# EAGLE design SMT Nixie Board (HV5623) (EAGLE 9.6.2)
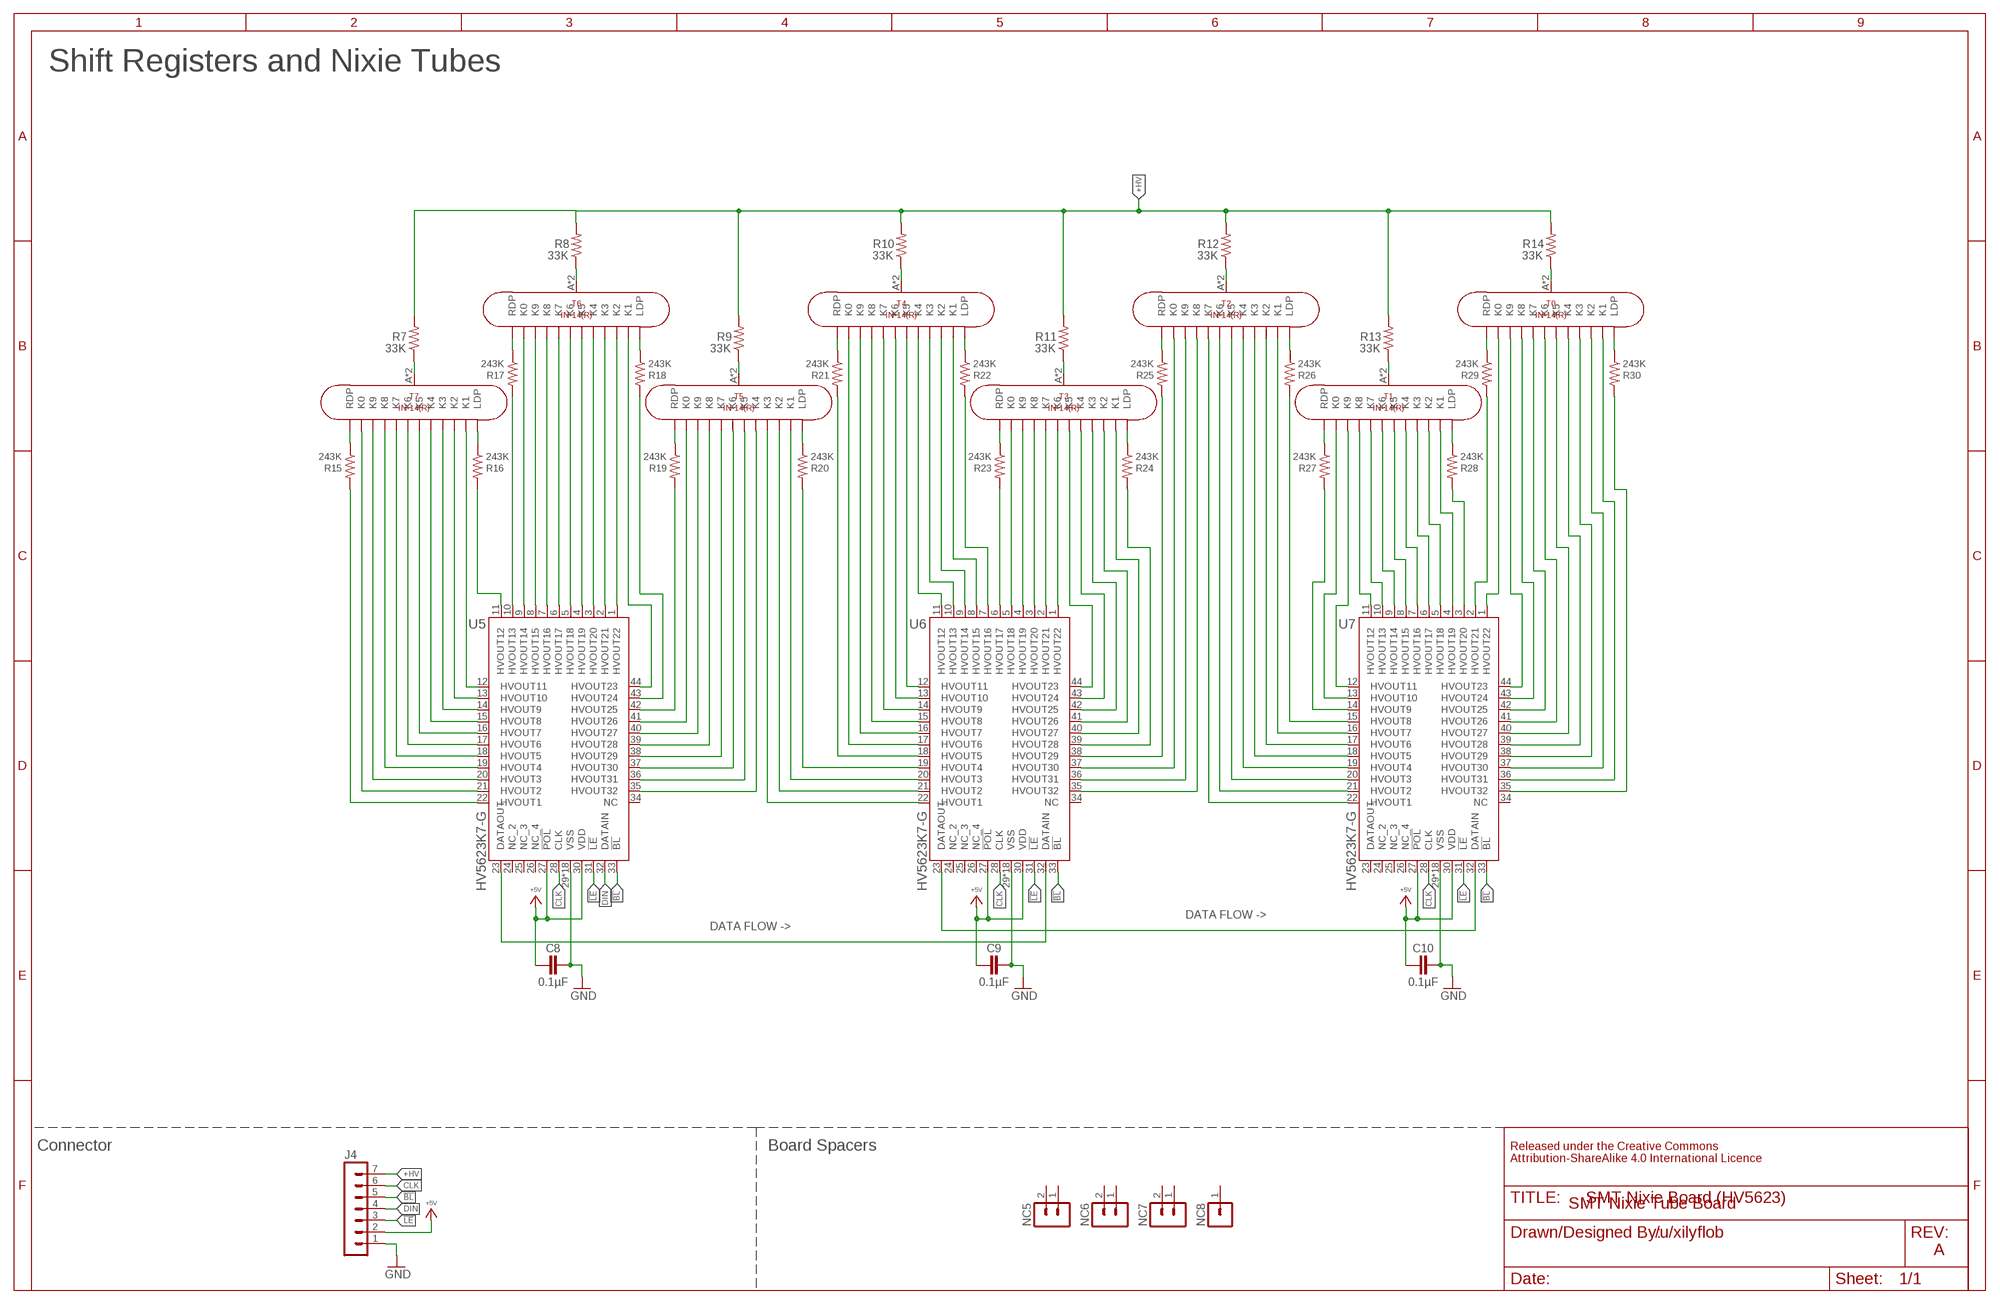
[diagram p0: schematic, sheet 1]

## Parts
C8  0.1µF  C-EU  [C0805]
C9  0.1µF  C-EU  [C0805]
C10  0.1µF  C-EU  [C0805]
J4  1  MA07  [MA07]
NC5  MA02  [MA02]
NC6  MA02  [MA02]
NC7  MA02  [MA02]
NC8  MA01  [MA01]
R7  33K  R-US_R2512  [R2512]
R8  33K  R-US_R2512  [R2512]
R9  33K  R-US_R2512  [R2512]
R10  33K  R-US_R2512  [R2512]
R11  33K  R-US_R2512  [R2512]
R12  33K  R-US_R2512  [R2512]
R13  33K  R-US_R2512  [R2512]
R14  33K  R-US_R2512  [R2512]
R15  243K  R-US_R2010  [R2010]
R16  243K  R-US_R2010  [R2010]
R17  243K  R-US_R2010  [R2010]
R18  243K  R-US_R2010  [R2010]
R19  243K  R-US_R2010  [R2010]
R20  243K  R-US_R2010  [R2010]
R21  243K  R-US_R2010  [R2010]
R22  243K  R-US_R2010  [R2010]
R23  243K  R-US_R2010  [R2010]
R24  243K  R-US_R2010  [R2010]
R25  243K  R-US_R2010  [R2010]
R26  243K  R-US_R2010  [R2010]
R27  243K  R-US_R2010  [R2010]
R28  243K  R-US_R2010  [R2010]
R29  243K  R-US_R2010  [R2010]
R30  243K  R-US_R2010  [R2010]
T0  IN-14(R)  [IN-14_REVERSE]
T1  IN-14(R)  [IN-14_REVERSE]
T2  IN-14(R)  [IN-14_REVERSE]
T3  IN-14(R)  [IN-14_REVERSE]
T4  IN-14(R)  [IN-14_REVERSE]
T5  IN-14(R)  [IN-14_REVERSE]
T6  IN-14(R)  [IN-14_REVERSE]
T7  IN-14(R)  [IN-14_REVERSE]
U5  HV5623K7-G  [WQFN-44]
U6  HV5623K7-G  [WQFN-44]
U7  HV5623K7-G  [WQFN-44]

## Nets
!BL!: J4.5 U5.33(!BL) U6.33(!BL) U7.33(!BL)
!LE!: J4.3 U5.31(!LE) U6.31(!LE) U7.31(!LE)
+5V: C8.1 C9.1 C10.1 J4.2 U5.27(!POL) U5.30(VDD) U6.27(!POL) U6.30(VDD) U7.27(!POL) U7.30(VDD)
+HV: J4.7 R7.2 R8.2 R9.2 R10.2 R11.2 R12.2 R13.2 R14.2
CLK: J4.6 U5.28(CLK) U6.28(CLK) U7.28(CLK)
DIN: J4.4 U5.32(DATAIN)
GND: C8.2 C9.2 C10.2 J4.1 U5.29(VSS) U5.P$1(VSS) U5.P$2(VSS) U5.P$3(VSS) U5.P$4(VSS) U5.P$5(VSS) U5.P$6(VSS) U5.P$7(VSS) U5.P$8(VSS) U5.P$9(VSS) U5.P$10(VSS) U5.P$11(VSS) U5.P$12(VSS) U5.P$13(VSS) U5.P$14(VSS) U5.P$15(VSS) U5.P$16(VSS) U5.TP(VSS) U6.29(VSS) U6.P$1(VSS) U6.P$2(VSS) U6.P$3(VSS) U6.P$4(VSS) U6.P$5(VSS) U6.P$6(VSS) U6.P$7(VSS) U6.P$8(VSS) U6.P$9(VSS) U6.P$10(VSS) U6.P$11(VSS) U6.P$12(VSS) U6.P$13(VSS) U6.P$14(VSS) U6.P$15(VSS) U6.P$16(VSS) U6.TP(VSS) U7.29(VSS) U7.P$1(VSS) U7.P$2(VSS) U7.P$3(VSS) U7.P$4(VSS) U7.P$5(VSS) U7.P$6(VSS) U7.P$7(VSS) U7.P$8(VSS) U7.P$9(VSS) U7.P$10(VSS) U7.P$11(VSS) U7.P$12(VSS) U7.P$13(VSS) U7.P$14(VSS) U7.P$15(VSS) U7.P$16(VSS) U7.TP(VSS)
T0A: R7.1 T7.A T7.A_1(A)
T1A: R8.1 T6.A T6.A_1(A)
T2A: R9.1 T5.A T5.A_1(A)
T3A: R10.1 T4.A T4.A_1(A)
T4A: R11.1 T3.A T3.A_1(A)
T5A: R12.1 T2.A T2.A_1(A)
T6A: R13.1 T1.A T1.A_1(A)
T7A: R14.1 T0.A T0.A_1(A)
U5-T0K0: T7.K0 T7.K0_1(K0) U5.21(HVOUT2)
U5-T0K1: T7.K1 T7.K1_1(K1) U5.12(HVOUT11)
U5-T0K2: T7.K2 T7.K2_1(K2) U5.13(HVOUT10)
U5-T0K3: T7.K3 T7.K3_1(K3) U5.14(HVOUT9)
U5-T0K4: T7.K4 T7.K4_1(K4) U5.15(HVOUT8)
U5-T0K5: T7.K5 T7.K5_1(K5) U5.16(HVOUT7)
U5-T0K6: T7.K6 T7.K6_1(K6) U5.17(HVOUT6)
U5-T0K7: T7.K7 T7.K7_1(K7) U5.18(HVOUT5)
U5-T0K8: T7.K8 T7.K8_1(K8) U5.19(HVOUT4)
U5-T0K9: T7.K9 T7.K9_1(K9) U5.20(HVOUT3)
U5-T0LDP: R16.2 U5.11(HVOUT12)
U5-T0LDP1: R16.1 T7.LDP T7.LDP_1(LDP)
U5-T0RDP: R15.2 U5.22(HVOUT1)
U5-T0RDP1: R15.1 T7.RDP T7.RDP_1(RDP)
U5-T1K0: T6.K0 T6.K0_1(K0) U5.9(HVOUT14)
U5-T1K1: T6.K1 T6.K1_1(K1) U5.44(HVOUT23)
U5-T1K2: T6.K2 T6.K2_1(K2) U5.1(HVOUT22)
U5-T1K3: T6.K3 T6.K3_1(K3) U5.2(HVOUT21)
U5-T1K4: T6.K4 T6.K4_1(K4) U5.3(HVOUT20)
U5-T1K5: T6.K5 T6.K5_1(K5) U5.4(HVOUT19)
U5-T1K6: T6.K6 T6.K6_1(K6) U5.5(HVOUT18)
U5-T1K7: T6.K7 T6.K7_1(K7) U5.6(HVOUT17)
U5-T1K8: T6.K8 T6.K8_1(K8) U5.7(HVOUT16)
U5-T1K9: T6.K9 T6.K9_1(K9) U5.8(HVOUT15)
U5-T1LDP: R18.2 U5.43(HVOUT24)
U5-T1LDP1: R18.1 T6.LDP T6.LDP_1(LDP)
U5-T1RDP: R17.2 U5.10(HVOUT13)
U5-T1RDP1: R17.1 T6.RDP T6.RDP_1(RDP)
U5-T2K0: T5.K0 T5.K0_1(K0) U5.41(HVOUT26)
U5-T2K4: T5.K4 T5.K4_1(K4) U5.35(HVOUT32)
U5-T2K5: T5.K5 T5.K5_1(K5) U5.36(HVOUT31)
U5-T2K6: T5.K6 T5.K6_1(K6) U5.37(HVOUT30)
U5-T2K7: T5.K7 T5.K7_1(K7) U5.38(HVOUT29)
U5-T2K8: T5.K8 T5.K8_1(K8) U5.39(HVOUT28)
U5-T2K9: T5.K9 T5.K9_1(K9) U5.40(HVOUT27)
U5-T2RDP: R19.2 U5.42(HVOUT25)
U5-T2RDP1: R19.1 T5.RDP T5.RDP_1(RDP)
U5-U6: U5.23(DATAOUT) U6.32(DATAIN)
U6-T2K1: T5.K1 T5.K1_1(K1) U6.20(HVOUT3)
U6-T2K2: T5.K2 T5.K2_1(K2) U6.21(HVOUT2)
U6-T2K3: T5.K3 T5.K3_1(K3) U6.22(HVOUT1)
U6-T2LDP: R20.2 U6.19(HVOUT4)
U6-T2LDP1: R20.1 T5.LDP T5.LDP_1(LDP)
U6-T3K0: T4.K0 T4.K0_1(K0) U6.17(HVOUT6)
U6-T3K1: T4.K1 T4.K1_1(K1) U6.8(HVOUT15)
U6-T3K2: T4.K2 T4.K2_1(K2) U6.9(HVOUT14)
U6-T3K3: T4.K3 T4.K3_1(K3) U6.10(HVOUT13)
U6-T3K4: T4.K4 T4.K4_1(K4) U6.11(HVOUT12)
U6-T3K5: T4.K5 T4.K5_1(K5) U6.12(HVOUT11)
U6-T3K6: T4.K6 T4.K6_1(K6) U6.13(HVOUT10)
U6-T3K7: T4.K7 T4.K7_1(K7) U6.14(HVOUT9)
U6-T3K8: T4.K8 T4.K8_1(K8) U6.15(HVOUT8)
U6-T3K9: T4.K9 T4.K9_1(K9) U6.16(HVOUT7)
U6-T3LDP: R22.2 U6.7(HVOUT16)
U6-T3LDP1: R22.1 T4.LDP T4.LDP_1(LDP)
U6-T3RDP: R21.2 U6.18(HVOUT5)
U6-T3RDP1: R21.1 T4.RDP T4.RDP_1(RDP)
U6-T4K0: T3.K0 T3.K0_1(K0) U6.5(HVOUT18)
U6-T4K1: T3.K1 T3.K1_1(K1) U6.40(HVOUT27)
U6-T4K2: T3.K2 T3.K2_1(K2) U6.41(HVOUT26)
U6-T4K3: T3.K3 T3.K3_1(K3) U6.42(HVOUT25)
U6-T4K4: T3.K4 T3.K4_1(K4) U6.43(HVOUT24)
U6-T4K5: T3.K5 T3.K5_1(K5) U6.44(HVOUT23)
U6-T4K6: T3.K6 T3.K6_1(K6) U6.1(HVOUT22)
U6-T4K7: T3.K7 T3.K7_1(K7) U6.2(HVOUT21)
U6-T4K8: T3.K8 T3.K8_1(K8) U6.3(HVOUT20)
U6-T4K9: T3.K9 T3.K9_1(K9) U6.4(HVOUT19)
U6-T4LDP: R24.2 U6.39(HVOUT28)
U6-T4LDP1: R24.1 T3.LDP T3.LDP_1(LDP)
U6-T4RDP: R23.2 U6.6(HVOUT17)
U6-T4RDP1: R23.1 T3.RDP T3.RDP_1(RDP)
U6-T5K0: T2.K0 T2.K0_1(K0) U6.37(HVOUT30)
U6-T5K8: T2.K8 T2.K8_1(K8) U6.35(HVOUT32)
U6-T5K9: T2.K9 T2.K9_1(K9) U6.36(HVOUT31)
U6-T5RDP: R25.2 U6.38(HVOUT29)
U6-T5RDP1: R25.1 T2.RDP T2.RDP_1(RDP)
U6-U7: U6.23(DATAOUT) U7.32(DATAIN)
U7-T5K1: T2.K1 T2.K1_1(K1) U7.16(HVOUT7)
U7-T5K2: T2.K2 T2.K2_1(K2) U7.17(HVOUT6)
U7-T5K3: T2.K3 T2.K3_1(K3) U7.18(HVOUT5)
U7-T5K4: T2.K4 T2.K4_1(K4) U7.19(HVOUT4)
U7-T5K5: T2.K5 T2.K5_1(K5) U7.20(HVOUT3)
U7-T5K6: T2.K6 T2.K6_1(K6) U7.21(HVOUT2)
U7-T5K7: T2.K7 T2.K7_1(K7) U7.22(HVOUT1)
U7-T5LDP: R26.2 U7.15(HVOUT8)
U7-T5LDP1: R26.1 T2.LDP T2.LDP_1(LDP)
U7-T6K0: T1.K0 T1.K0_1(K0) U7.13(HVOUT10)
U7-T6K1: T1.K1 T1.K1_1(K1) U7.4(HVOUT19)
U7-T6K2: T1.K2 T1.K2_1(K2) U7.5(HVOUT18)
U7-T6K3: T1.K3 T1.K3_1(K3) U7.6(HVOUT17)
U7-T6K4: T1.K4 T1.K4_1(K4) U7.7(HVOUT16)
U7-T6K5: T1.K5 T1.K5_1(K5) U7.8(HVOUT15)
U7-T6K6: T1.K6 T1.K6_1(K6) U7.9(HVOUT14)
U7-T6K7: T1.K7 T1.K7_1(K7) U7.10(HVOUT13)
U7-T6K8: T1.K8 T1.K8_1(K8) U7.11(HVOUT12)
U7-T6K9: T1.K9 T1.K9_1(K9) U7.12(HVOUT11)
U7-T6LDP: R28.2 U7.3(HVOUT20)
U7-T6LDP1: R28.1 T1.LDP T1.LDP_1(LDP)
U7-T6RDP: R27.2 U7.14(HVOUT9)
U7-T6RDP1: R27.1 T1.RDP T1.RDP_1(RDP)
U7-T7K0: T0.K0 T0.K0_1(K0) U7.1(HVOUT22)
U7-T7K1: T0.K1 T0.K1_1(K1) U7.36(HVOUT31)
U7-T7K2: T0.K2 T0.K2_1(K2) U7.37(HVOUT30)
U7-T7K3: T0.K3 T0.K3_1(K3) U7.38(HVOUT29)
U7-T7K4: T0.K4 T0.K4_1(K4) U7.39(HVOUT28)
U7-T7K5: T0.K5 T0.K5_1(K5) U7.40(HVOUT27)
U7-T7K6: T0.K6 T0.K6_1(K6) U7.41(HVOUT26)
U7-T7K7: T0.K7 T0.K7_1(K7) U7.42(HVOUT25)
U7-T7K8: T0.K8 T0.K8_1(K8) U7.43(HVOUT24)
U7-T7K9: T0.K9 T0.K9_1(K9) U7.44(HVOUT23)
U7-T7LDP: R30.2 U7.35(HVOUT32)
U7-T7LDP1: R30.1 T0.LDP T0.LDP_1(LDP)
U7-T7RDP: R29.2 U7.2(HVOUT21)
U7-T7RDP1: R29.1 T0.RDP T0.RDP_1(RDP)
Unconnected: NC5.1 NC5.2 NC6.1 NC6.2 NC7.1 NC7.2 NC8.1 U5.24(NC_2) U5.25(NC_3) U5.26(NC_4) U5.34(NC) U6.24(NC_2) U6.25(NC_3) U6.26(NC_4) U6.34(NC) U7.23(DATAOUT) U7.24(NC_2) U7.25(NC_3) U7.26(NC_4) U7.34(NC)

## Notes on the sheet
- Shift Registers and Nixie Tubes
- DATA FLOW ->
- DATA FLOW ->
- Connector | Board Spacers
- Released under the Creative Commons
  Attribution-ShareAlike 4.0 International Licence
- SMT Nixie Tube Board
- /u/xilyflob
- A

## Library data of the parts
C8-C10 = My Imported Components:C-EU
J4 = My Imported Components:MA07: PIN HEADER; OC_FARNELL: unknown; OC_NEWARK: unknown
NC5-NC7 = My Imported Components:MA02: PIN HEADER
NC8 = My Imported Components:MA01: PIN HEADER
R7-R30 = rcl:R-US_: RESISTOR, American symbol; SPICEPREFIX: R
T0 T1-T7 = My Imported Components:IN-14
U5-U7 = My Imported Components:HV5623K7-G

## Board
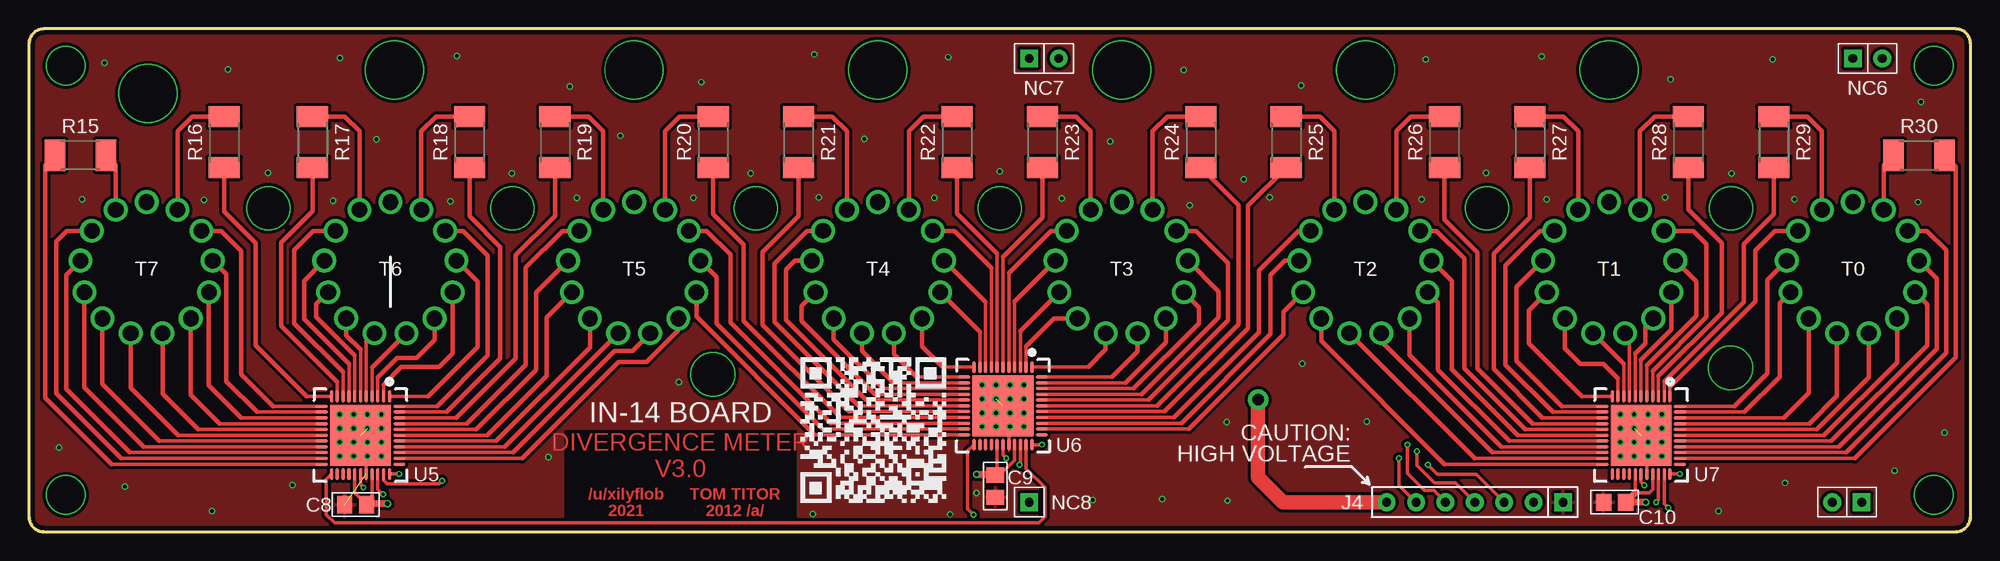
[diagram p1: board, top side]
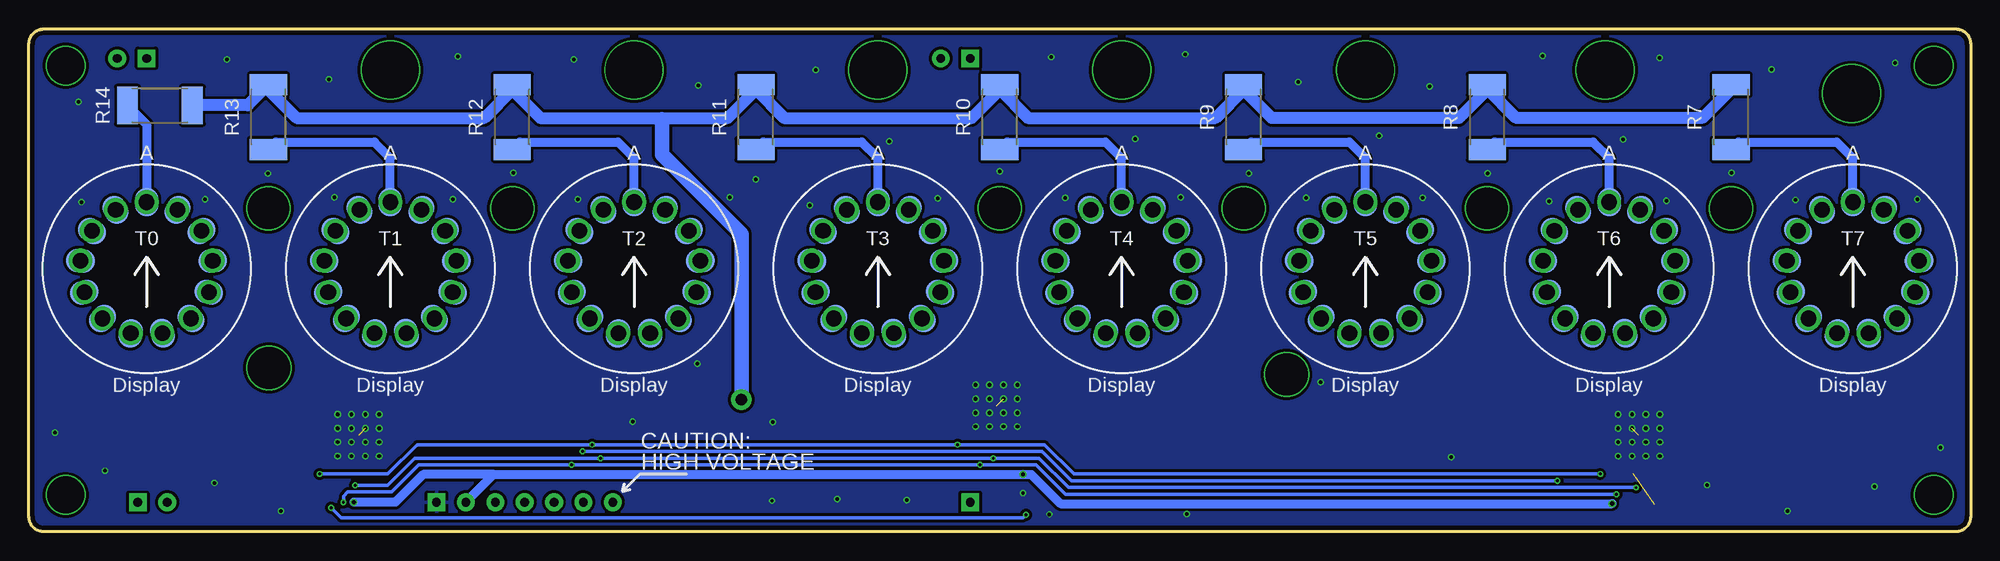
[diagram p2: board, bottom side, seen from below]

Size 167.64 x 43.43 mm. Coordinates in mm from the lower left corner, seen from the top.
Outline: 167.64,1.27 167.64,42.16 arc90 166.37,43.43 1.27,43.43 arc90 0,42.16 0,1.27 arc90 1.27,0 166.37,0 arc90 167.64,1.27
Copper layers (1*16): Top 0.035559375mm / dielectric 1.6mm / Bottom 0.035559375mm
Design rules "oshpark-2layer *": minimum track width 6mil, minimum drill 10mil, track to track 6mil, track to pad 6mil, pad to pad 6mil, via to via 6mil, smd to smd 6mil, copper to edge 15mil, drill to drill 6mil, minimum pad ring 5mil, minimum via ring 5mil, stop-mask expansion 2.5mil, vias tented up to drill 30mil, thermal gap 10mil

### Footprints (pad centres in the part's own frame; a part is rotated, then mirrored left to right if it is on the bottom)
C0805 = smd 1.3 x 1.5: 1 -0.95,0; 2 0.95,0
MA07 = drill 0.75 pad 1.524 square: 1 -7.62,0 | drill 0.75 pad 1.524: 2 -5.08,0; 3 -2.54,0; 4 0,0; 5 2.54,0; 6 5.08,0; 7 7.62,0
MA02 = drill 0.75 pad 1.524 square: 1 -1.27,0 | drill 0.75 pad 1.524: 2 1.27,0
MA01 = drill 0.75 pad 1.524 square: 1 0,0
R2512 = smd 1.8 x 3.2: 1 -2.8,0; 2 2.8,0
R2010 = smd 1.8 x 2.7: 1 -2.2,0; 2 2.2,0
IN-14_REVERSE = drill 1.35 pad 2.05: A 0,5.75; K0 4.732,3.266; K1 -4.732,3.266; K2 -5.708,0.693; K3 -5.376,-2.039; K4 -3.813,-4.304; K5 -1.376,-5.583; K6 1.376,-5.583; K7 3.813,-4.304; K8 5.376,-2.039; K9 5.708,0.693; LDP -2.672,5.091; RDP 2.672,5.091 | smd 2.05 x 2.5: A_1 0,5.75 | smd 2.05 x 2.5 rotated 124.6: K0_1 4.732,3.266 | smd 2.05 x 2.5 rotated 235.4: K1_1 -4.732,3.266 | smd 2.05 x 2.5 rotated 263.1: K2_1 -5.708,0.693 | smd 2.05 x 2.5 rotated 290.7: K3_1 -5.376,-2.039 | smd 2.05 x 2.5 rotated 318.4: K4_1 -3.813,-4.304 | smd 2.05 x 2.5 rotated 346.1: K5_1 -1.376,-5.583 | smd 2.05 x 2.5 rotated 13.9: K6_1 1.376,-5.583 | smd 2.05 x 2.5 rotated 41.6: K7_1 3.813,-4.304 | smd 2.05 x 2.5 rotated 69.3: K8_1 5.376,-2.039 | smd 2.05 x 2.5 rotated 96.9: K9_1 5.708,0.693 | smd 2.05 x 2.5 rotated 207.7: LDP_1 -2.672,5.091 | smd 2.05 x 2.5 rotated 152.3: RDP_1 2.672,5.091
WQFN-44 = smd 1.05 x 0.3: 1 -3.35,2.5; 2 -3.35,2; 3 -3.35,1.5; 4 -3.35,1; 5 -3.35,0.5; 6 -3.35,0; 7 -3.35,-0.5; 8 -3.35,-1; 9 -3.35,-1.5; 10 -3.35,-2; 11 -3.35,-2.5; 23 3.35,-2.5; 24 3.35,-2; 25 3.35,-1.5; 26 3.35,-1; 27 3.35,-0.5; 28 3.35,0; 29 3.35,0.5; 30 3.35,1; 31 3.35,1.5; 32 3.35,2; 33 3.35,2.5 | smd 0.3 x 1.05: 12 -2.5,-3.35; 13 -2,-3.35; 14 -1.5,-3.35; 15 -1,-3.35; 16 -0.5,-3.35; 17 0,-3.35; 18 0.5,-3.35; 19 1,-3.35; 20 1.5,-3.35; 21 2,-3.35; 22 2.5,-3.35; 34 2.5,3.35; 35 2,3.35; 36 1.5,3.35; 37 1,3.35; 38 0.5,3.35; 39 0,3.35; 40 -0.5,3.35; 41 -1,3.35; 42 -1.5,3.35; 43 -2,3.35; 44 -2.5,3.35 | drill 0.33 pad 0.406: P$1 0.6,0.6; P$2 0.6,-0.6; P$3 -0.6,-0.6; P$4 -0.6,0.6; P$5 -0.6,1.8; P$6 0.6,1.8; P$7 0.6,-1.8; P$8 -0.6,-1.8; P$9 -1.8,-1.8; P$10 -1.8,-0.6; P$11 -1.8,0.6; P$12 -1.8,1.8; P$13 1.8,1.8; P$14 1.8,0.6; P$15 1.8,-0.6; P$16 1.8,-1.8 | smd 5.25 x 5.25: TP 0,0

### Placement (x,y rotation side)
C8  28.19,2.34 180 top
C9  83.44,3.94 270 top
C10  136.91,2.54 180 top
J4  124.84,2.54 180 top
NC5  156.97,2.54 180 top
NC6  158.75,40.89 0 top
NC7  87.63,40.89 0 top
NC8  86.36,2.54 180 top
R7  20.68,35.81 90 bottom
R8  41.73,35.81 90 bottom
R9  62.76,35.81 90 bottom
R10  83.82,35.81 90 bottom
R11  104.88,35.81 90 bottom
R12  125.91,35.81 90 bottom
R13  146.96,35.81 90 bottom
R14  156.34,36.83 0 bottom
R15  4.45,32.51 180 top
R16  16.87,33.66 270 top
R17  24.49,33.66 270 top
R18  38.05,33.66 270 top
R19  45.42,33.66 270 top
R20  59.08,33.66 270 top
R21  66.45,33.66 270 top
R22  80.14,33.66 270 top
R23  87.5,33.66 270 top
R24  101.19,33.66 270 top
R25  108.56,33.66 270 top
R26  122.22,33.66 270 top
R27  129.59,33.66 270 top
R28  143.28,33.66 270 top
R29  150.65,33.66 270 top
R30  163.19,32.51 0 top
T0  157.48,22.73 0 bottom
T1  136.43,22.73 0 bottom
T2  115.39,22.73 0 bottom
T3  94.34,22.73 0 bottom
T4  73.3,22.73 0 bottom
T5  52.25,22.73 0 bottom
T6  31.21,22.73 0 bottom
T7  10.16,22.73 0 bottom
U5  28.63,8.33 270 top
U6  84.1,10.87 270 top
U7  139.19,8.33 270 top

### Tracks (layer width: path | path; a pad name or v marks a point on that pad's centre or on a via)
!BL!  (via drill 0.25)
  Top 0.3: U5.33 v31.98,4.98 | U7.33 v142.54,4.98 | U6.33 v87.45,7.52 | J4.5 121.28,3.56 120.5,3.56 119.02,5.03 v119.02,7.52
  Bottom 0.3: v31.98,4.98 77.42,4.98 79.96,7.52 v87.45,7.52 v119.02,7.52 134.11,7.52 136.65,4.98 v142.54,4.98
!LE!  (via drill 0.25)
  Top 0.3: v30.58,3.23 30.13,3.68 U5.31 | v85.52,5.77 85.6,5.84 U6.31 | U7.31 140.69,2.75 v140.49,2.54 | J4.3 124.97,4.95 121.61,4.95 v120.8,5.77
  Bottom 0.3: v30.58,3.23 78.13,3.23 80.67,5.77 v85.52,5.77 v120.8,5.77 134.01,5.77 136.32,3.45 140.1,3.45 140.49,3.07 v140.49,2.54
+5V  (via drill 0.38)
  Top 0.3: U7.27 138.69,3.38 139.9,3.38 140.19,3.67 U7.30 | U5.30 29.63,2.82 C8.1 28.13,3.35 U5.27 | U6.27 83.6,5.05 C9.1 83.81,4.89 85.1,6.18 U6.30
  Top 0.6: 138.69,3.38 C10.1 v139.6,2.54 | v30.96,2.41 29.22,2.41 C8.1 | v81.81,4.95 83.37,4.95 C9.1
  Bottom 0.762: v30.96,2.41 78.56,2.41 81.1,4.95 v81.81,4.95 83.24,4.95 84.68,4.95 87.43,4.95 127.48,4.95 | 127.48,4.95 133.6,4.95 136.02,2.54 v139.6,2.54 | J4.2 127.51,4.95 127.48,4.95
+HV  (via drill 1 pad 1.78)
  Top 1.27: v106.12,11.4 106.12,4.7 108.28,2.54 J4.7
  Bottom 0.762: 112.98,35.23 112.98,35.74
  Bottom 1.016: 62.77,38.18 65.21,35.74 81.38,35.74 83.82,38.18 | 83.82,38.18 86.26,35.74 102.43,35.74 104.88,38.19 R11.2 104.88,38.16 107.3,35.74 112.98,35.74 123.47,35.74 125.91,38.17 R12.2 125.91,38.18 128.35,35.74 144.52,35.74 146.96,38.18 R13.2 148.75,36.83 R14.2 | R8.2 41.73,38.23 | 41.73,38.23 41.73,38.18 44.17,35.74 60.33,35.74 62.77,38.18 | 41.73,38.23 39.29,35.79 23.11,35.79 20.68,38.23 R7.2 | R10.2 83.82,38.18 | R9.2 62.77,38.18
  Bottom 1.27: v106.12,11.4 106.12,25.73 112.98,32.59 112.98,35.23
CLK  (via drill 0.25)
  Top 0.3: v28.88,3.81 28.63,4.06 U5.28 | v139.47,4.01 139.19,4.29 U7.28 | v84.38,6.35 84.1,6.63 U6.28 | J4.6 118.29,4.01 v118.29,6.35
  Bottom 0.3: v28.88,3.81 77.88,3.81 80.42,6.35 v84.38,6.35 v118.29,6.35 134.34,6.35 136.68,4.01 v139.47,4.01
DIN  (via drill 0.25)
  Top 0.3: U5.32 30.63,4.45 30.94,4.14 35.41,4.14 v35.66,4.39 | J4.4 123.17,4.22 121.34,4.22 119.84,5.71 v119.84,6.93
  Bottom 0.3: v35.66,4.39 77.65,4.39 80.19,6.93 v119.84,6.93
GND  (via drill 0.3)  (4 unrouted)
  Top 0.3: U6.29 84.6,8.97 U6.P$14 | U5.29 29.13,6.43 U5.P$14 | U7.29 139.69,6.43 U7.P$14
  other vias: 17.17,39.93 26.85,40.94 30,33.91 56.11,12.9 8.31,3.89 15.8,1.78 22.76,4.04 44.83,6.43 79.53,1.5 103.48,2.67 103.43,9.45 109.93,14.53 115.52,9.53 145.87,1.78 151.64,4.22 161.09,5.26 165.38,8.56 163.12,28.47 163.37,37.13 150.55,40.79 152.43,28.73 147.02,30.94 141.25,28.88 141.76,39.09 131.04,28.73 130.61,41.07 125.83,31.01 120.6,40.79 120.24,28.73 109.86,38.56 107.14,28.88 104.88,30.45 99.69,39.9 100.23,28.19 93.34,33.71 79.38,41 89.15,28.8 83.82,31.14 78.16,28.83 72.11,33.93 67.79,41.25 68.2,28.88 62.31,30.96 58.04,38.84 57.35,28.83 51.08,34.21 47.29,28.83 46.71,38.48 41.71,30.96 36.4,28.55 36.93,41.1 26.26,28.6 20.62,31.01 15.11,28.65 6.5,40.49 4.6,28.73 91.85,2.74 67.67,1.52 97.84,2.82 2.59,7.26 81.81,3.35
  pour Bottom (isolate 0.254): 166.37,0.46 1.27,0.46 arc-90 0.46,1.27 0.46,42.16 arc-90 1.27,42.98 166.37,42.98 arc-90 167.18,42.16 167.18,1.27 arc-90
  pour Top (isolate 0.254): 166.37,0.46 1.27,0.46 arc-90 0.46,1.27 0.46,42.16 arc-90 1.27,42.98 166.37,42.98 arc-90 167.18,42.16 167.18,1.27 arc-90
  cutout Top: 46.23,8.76 66.29,8.76 66.29,0.2 46.23,0.2
N$1  (via drill 3.66)
  other vias: 59.05,13.59
N$2  (via drill 4.88)
  other vias: 52.25,39.88
N$3  (via drill 3.58)
  other vias: 83.82,27.94
N$4  (via drill 3.58)
  other vias: 62.76,27.94
N$5  (via drill 3.58)
  other vias: 20.68,27.94
N$6  (via drill 3.66)
  other vias: 146.91,14.15
N$7  (via drill 4.88)
  other vias: 115.39,39.88
N$8  (via drill 3.58)
  other vias: 41.73,27.94
N$9  (via drill 3.58)
  other vias: 146.96,27.94
N$10  (via drill 3.17)
  other vias: 3.17,3.17
N$11  (via drill 3.17)
  other vias: 164.47,3.17
N$12  (via drill 3.17)
  other vias: 3.17,40.26
N$13  (via drill 3.17)
  other vias: 164.47,40.26
N$14  (via drill 4.88)
  other vias: 73.29,39.88
N$15  (via drill 4.88)
  other vias: 94.35,39.88
N$16  (via drill 4.88)
  other vias: 136.44,39.88
N$17  (via drill 4.88)
  other vias: 31.55,39.88
N$18  (via drill 3.58)
  other vias: 125.91,27.94
N$19  (via drill 4.88)
  other vias: 10.29,37.85
T0A
  Bottom 0.762: T7.A_1 10.16,32.26 11.56,33.66 20.04,33.66 R7.1
T1A
  Bottom 0.762: T6.A_1 31.21,32.26 32.6,33.66 41.09,33.66 R8.1
T2A
  Bottom 0.762: T5.A_1 52.25,32.26 53.65,33.66 62.12,33.66 R9.1
T3A
  Bottom 0.762: T4.A_1 73.3,32.26 74.69,33.66 83.18,33.66 R10.1
T4A
  Bottom 0.762: T3.A_1 94.34,32.26 95.74,33.66 104.24,33.66 R11.1
T5A
  Bottom 0.762: T2.A_1 115.39,32.26 116.79,33.66 125.27,33.66 R12.1
T6A
  Bottom 0.762: T1.A_1 136.43,32.26 137.83,33.66 146.32,33.66 R13.1
T7A
  Bottom 0.762: R14.1 157.48,35.17 T0.A_1
U5-T0K0
  Top 0.3: U5.21 7.97,6.33
  Top 0.381: T7.K0_1 3.25,25.99 2.34,25.08 2.34,11.96 7.97,6.33
U5-T0K1
  Top 0.3: U5.12 21.08,10.83
  Top 0.381: T7.K1_1 16.58,25.99 18.31,24.26 18.31,13.6 21.08,10.83
U5-T0K2
  Top 0.3: U5.13 19.68,10.33
  Top 0.381: T7.K2_1 | T7.K2_1 17.04,22.24 17.04,12.97 19.68,10.33
U5-T0K3
  Top 0.3: U5.14 18.33,9.83
  Top 0.381: T7.K3_1 15.54,12.62 18.33,9.83
U5-T0K4
  Top 0.3: U5.15 16.48,9.33
  Top 0.381: T7.K4_1 13.97,11.84 16.48,9.33
U5-T0K5
  Top 0.3: U5.16 14.59,8.83
  Top 0.381: T7.K5_1 11.54,11.89 14.59,8.83
U5-T0K6
  Top 0.3: U5.17 12.87,8.33
  Top 0.381: T7.K6_1 8.78,12.42 12.87,8.33
U5-T0K7
  Top 0.3: U5.18 11.27,7.83
  Top 0.381: T7.K7_1 6.35,12.75 11.27,7.83
U5-T0K8
  Top 0.3: U5.19 9.9,7.33
  Top 0.381: T7.K8_1 4.78,12.45 9.9,7.33
U5-T0K9
  Top 0.3: U5.20 8.71,6.83
  Top 0.381: T7.K9_1 3.23,22.19 3.23,12.32 8.71,6.83
U5-T0LDP
  Top 0.3: U5.11 23.98,11.68
  Top 0.381: R16.2 16.87,27.66 19.58,24.94 19.58,18.9 19.58,16.08 23.98,11.68
U5-T0LDP1
  Top 0.381: T7.LDP_1 12.83,34.59 14.1,35.85 R16.1
U5-T0RDP
  Top 0.3: U5.22 7.15,5.83
  Top 0.381: R15.2 1.42,31.69 1.42,11.56 7.15,5.83
U5-T0RDP1
  Top 0.381: T7.RDP_1 7.49,31.67 R15.1
U5-T1K0
  Top 0.3: U5.9 27.13,13.78
  Top 0.381: 27.13,13.78 22.9,18.01 22.9,24.33 24.56,25.99 T6.K0_1
U5-T1K1
  Top 0.3: U5.44 35.23,10.83
  Top 0.381: T6.K1_1 37.47,25.99 39.61,23.85 39.61,15.21 35.23,10.83
U5-T1K2
  Top 0.3: U5.1 34.47,11.68
  Top 0.381: T6.K2_1 38.72,21.61 38.72,16.38 38.72,15.94 34.47,11.68 | T6.K2_1
U5-T1K3
  Top 0.3: U5.2 30.63,12.69
  Top 0.381: T6.K3_1 36.58,15.4 35.41,14.22 32.16,14.22 30.63,12.69
U5-T1K4
  Top 0.3: U5.3 30.13,13.34
  Top 0.381: T6.K4_1 35.02,16.55 33.48,15.01 31.8,15.01 30.13,13.34
U5-T1K5
  Top 0.3: U5.4 29.63,14.19
  Top 0.381: 29.63,14.19 T6.K5_1
U5-T1K6
  Top 0.3: U5.5 29.13,16.44
  Top 0.381: 29.13,16.44 T6.K6_1
U5-T1K7
  Top 0.3: U5.6 28.63,15.72
  Top 0.381: T6.K7_1 27.39,16.96 28.63,15.72
U5-T1K8
  Top 0.3: U5.7 28.13,15.22
  Top 0.381: T6.K8_1 24.8,19.66 24.8,18.54 28.13,15.22
U5-T1K9
  Top 0.3: U5.8 27.63,14.49
  Top 0.381: 27.63,14.49 23.75,18.36 23.75,21.67 T6.K9_1
U5-T1LDP
  Top 0.3: U5.43 36.06,10.33
  Top 0.381: R18.2 38.05,27.25 40.69,24.61 40.69,14.96 36.06,10.33
U5-T1LDP1
  Top 0.381: R18.1 35.15,35.85 33.88,34.59 T6.LDP_1
U5-T1RDP
  Top 0.3: U5.10 26.63,12.95
  Top 0.381: 26.63,12.95 21.79,17.78 21.79,24.99 24.49,27.69 R17.2
U5-T1RDP1
  Top 0.381: T6.RDP_1 28.53,34.59 27.26,35.85 R17.1
U5-T2K0
  Top 0.3: U5.41 37.78,9.33
  Top 0.381: T5.K0_1 46.06,25.99 42.88,22.81 42.88,14.43 37.78,9.33
U5-T2K4
  Top 0.3: U5.35 42.58,6.33
  Top 0.381: T5.K4_1 56.06,17.4 53.32,14.66 50.91,14.66 42.58,6.33
U5-T2K5
  Top 0.3: U5.36 41.78,6.83
  Top 0.381: T5.K5_1 52.11,15.62 50.58,15.62 41.78,6.83 | T5.K5_1
U5-T2K6
  Top 0.3: U5.37 41.06,7.33
  Top 0.381: 41.06,7.33 T5.K6_1
U5-T2K7
  Top 0.3: U5.38 40.35,7.83
  Top 0.381: T5.K7_1 48.44,15.92 40.35,7.83
U5-T2K8
  Top 0.3: U5.39 39.58,8.33
  Top 0.381: T5.K8_1 44.68,18.49 44.68,13.44 39.58,8.33
U5-T2K9
  Top 0.3: U5.40 38.63,8.83
  Top 0.381: T5.K9_1 43.77,20.64 43.77,13.97 38.63,8.83
U5-T2RDP
  Top 0.3: U5.42 36.88,9.83
  Top 0.381: R19.2 45.41,27.26 42.04,23.88 42.04,14.99 36.88,9.83
U5-T2RDP1
  Top 0.381: R19.1 48.31,35.85 49.58,34.59 T5.RDP_1
U5-U6
  Top 0.3: U5.23 25.67,4.52 25.67,1.47 26.38,0.76 87.22,0.76 87.72,1.27 87.72,3.81 86.1,5.44 U6.32
U6-T2K1
  Top 0.3: U6.20 69.27,9.37
  Top 0.381: T5.K1_1 58.52,25.99 60.58,23.93 60.58,18.06 69.27,9.37
U6-T2K2
  Top 0.3: U6.21 68.53,8.87
  Top 0.381: T5.K2_1 59.39,21.99 59.39,18.01 68.53,8.87
U6-T2K3
  Top 0.3: U6.22 67.83,8.37
  Top 0.381: T5.K3_1 57.63,18.58 67.83,8.37
U6-T2LDP
  Top 0.3: U6.19 70.06,9.87
  Top 0.381: R20.2 59.08,27.46 61.72,24.82 61.72,18.21 70.06,9.87
U6-T2LDP1
  Top 0.381: R20.1 56.19,35.85 54.92,34.59 T5.LDP_1
U6-T3K0
  Top 0.3: U6.17 71.62,10.87
  Top 0.381: T4.K0_1 67.18,25.99 64.36,23.16 64.36,18.14 71.62,10.87
U6-T3K1
  Top 0.3: U6.8 83.1,22.79
  Top 0.381: T4.K1_1 79.89,25.99 83.1,22.79
U6-T3K2
  Top 0.3: U6.9 82.6,19.82
  Top 0.381: 82.6,19.82 T4.K2_1
U6-T3K3
  Top 0.3: U6.10 82.1,17.26
  Top 0.381: 82.1,17.26 T4.K3_1
U6-T3K4
  Top 0.3: U6.11 78.87,14.22
  Top 0.381: T4.K4_1 77.11,15.98 78.87,14.22
U6-T3K5
  Top 0.3: U6.12 76.61,13.37
  Top 0.381: T4.K5_1 74.67,15.31 76.61,13.37
U6-T3K6
  Top 0.3: U6.13 74.65,12.87
  Top 0.381: T4.K6_1 71.92,15.6 74.65,12.87
U6-T3K7
  Top 0.3: U6.14 73.73,12.37
  Top 0.381: T4.K7_1 69.48,16.61 73.73,12.37
U6-T3K8
  Top 0.3: U6.15 73.06,11.87
  Top 0.381: T4.K8_1 66.72,19.48 66.72,18.21 73.06,11.87
U6-T3K9
  Top 0.3: U6.16 72.29,11.37
  Top 0.381: T4.K9_1 66.13,23.42 65.37,22.66 65.37,18.29 72.29,11.37
U6-T3LDP
  Top 0.3: U6.7 83.6,24.03
  Top 0.381: R22.2 80.14,27.5 83.6,24.03
U6-T3LDP1
  Top 0.381: R22.1 77.24,35.85 75.97,34.59 T4.LDP_1
U6-T3RDP
  Top 0.3: U6.18 70.81,10.37
  Top 0.381: R21.2 66.45,27.27 63.32,24.14 63.32,17.86 70.81,10.37
U6-T3RDP1
  Top 0.381: R21.1 69.36,35.85 70.62,34.59 T4.RDP_1
U6-T4K0
  Top 0.3: U6.5 84.6,22.36
  Top 0.381: T3.K0_1 88.23,25.99 84.6,22.36
U6-T4K1
  Top 0.3: U6.40 96.66,11.37
  Top 0.381: T3.K1_1 100.75,25.99 103.53,23.22 103.53,18.24 96.66,11.37
U6-T4K2
  Top 0.3: U6.41 96.05,11.87
  Top 0.381: T3.K2_1 102.7,20.77 102.7,18.52 96.05,11.87
U6-T4K3
  Top 0.3: U6.42 95.39,12.37
  Top 0.381: T3.K3_1 101.02,19.38 101.02,18.01 95.39,12.37
U6-T4K4
  Top 0.3: U6.43 94.69,12.87
  Top 0.381: T3.K4_1 98.16,16.34 94.69,12.87
U6-T4K5
  Top 0.3: U6.44 93.52,13.37
  Top 0.381: T3.K5_1 95.72,15.57 93.52,13.37
U6-T4K6
  Top 0.3: U6.1 91.46,14.22
  Top 0.381: T3.K6_1 92.97,15.72 91.46,14.22
U6-T4K7
  Top 0.3: U6.2 86.1,16
  Top 0.381: T3.K7_1 88.52,18.42 86.1,16
U6-T4K8
  Top 0.3: U6.3 85.6,17.32
  Top 0.381: 85.6,17.32 T3.K8_1
U6-T4K9
  Top 0.3: U6.4 85.1,19.88
  Top 0.381: 85.1,19.88 T3.K9_1
U6-T4LDP
  Top 0.3: U6.39 97.41,10.87
  Top 0.381: R24.2 104.42,28.23 104.42,17.88 97.41,10.87
U6-T4LDP1
  Top 0.381: R24.1 98.28,35.85 97.02,34.59 T3.LDP_1
U6-T4RDP
  Top 0.3: U6.6 84.1,23.75
  Top 0.381: R23.2 87.5,27.15 84.1,23.75
U6-T4RDP1
  Top 0.381: R23.1 90.4,35.85 91.67,34.59 T3.RDP_1
U6-T5K0
  Top 0.3: U6.37 98.84,9.87
  Top 0.381: T2.K0_1 109.61,25.99 106.19,22.58 106.19,17.22 98.84,9.87
U6-T5K8
  Top 0.3: U6.35 100.16,8.87
  Top 0.381: T2.K8_1 108.33,19 108.33,17.04 100.16,8.87
U6-T5K9
  Top 0.3: U6.36 99.51,9.37
  Top 0.381: T2.K9_1 108.45,23.42 107.21,22.17 107.21,17.07 99.51,9.37
U6-T5RDP
  Top 0.3: U6.38 98.05,10.37
  Top 0.381: R25.2 105.26,28.15 105.26,17.58 98.05,10.37
U6-T5RDP1
  Top 0.381: R25.1 111.45,35.85 112.72,34.59 T2.RDP_1
U6-U7  (via drill 0.25)
  Top 0.3: U6.23 81.04,6.96 81.04,1.97 v81.56,1.45 | v141.55,2.06 141.19,2.42 U7.32
  Bottom 0.3: v81.56,1.45 81.81,1.19 140.69,1.19 v141.55,2.06
U7-T5K1
  Top 0.3: U7.16 129.21,8.83
  Top 0.381: T2.K1_1 121.53,25.99 123.92,23.6 123.92,14.12 129.21,8.83
U7-T5K2
  Top 0.3: U7.17 128.55,8.33
  Top 0.381: T2.K2_1 122.86,21.66 122.86,14.02 128.55,8.33
U7-T5K3
  Top 0.3: U7.18 127.8,7.83
  Top 0.381: T2.K3_1 121.64,19.82 121.64,13.99 127.8,7.83
U7-T5K4
  Top 0.3: U7.19 127.13,7.33
  Top 0.381: T2.K4_1 119.2,15.26 127.13,7.33
U7-T5K5
  Top 0.3: U7.20 126.36,6.83
  Top 0.381: T2.K5_1 116.77,16.43 126.36,6.83
U7-T5K6
  Top 0.3: U7.21 124.82,6.33
  Top 0.381: 124.82,6.33 T2.K6_1
U7-T5K7
  Top 0.3: U7.22 122.21,5.83
  Top 0.381: T2.K7_1 111.58,16.46 122.21,5.83
U7-T5LDP
  Top 0.3: U7.15 129.86,9.33
  Top 0.381: R26.2 122.22,26.95 125.07,24.11 125.07,14.12 129.86,9.33
U7-T5LDP1
  Top 0.381: R26.1 119.33,35.85 118.06,34.59 T2.LDP_1
U7-T6K0
  Top 0.3: U7.13 131.56,10.33
  Top 0.381: T1.K0_1 130.47,25.99 127.47,22.99 127.47,14.43 131.56,10.33
U7-T6K1
  Top 0.3: U7.4 140.19,13.91
  Top 0.381: T1.K1_1 143.72,25.99 144.84,24.87 144.84,19.79 144.84,18.56 140.19,13.91
U7-T6K2
  Top 0.3: U7.5 139.69,14.35
  Top 0.381: T1.K2_1 143.97,21.59 143.97,18.63 139.69,14.35
U7-T6K3
  Top 0.3: U7.6 139.19,14.83
  Top 0.381: T1.K3_1 141.81,18.01 141.81,17.45 139.19,14.83
U7-T6K4
  Top 0.3: U7.7 138.69,15.4
  Top 0.381: T1.K4_1 139.57,17.75 139.57,16.28 138.69,15.4
U7-T6K5
  Top 0.3: U7.8 138.19,16.76
  Top 0.381: 138.19,16.76 T1.K5_1
U7-T6K6
  Top 0.3: U7.9 137.69,14.51
  Top 0.381: 137.69,14.51 T1.K6_1
U7-T6K7
  Top 0.3: U7.10 137.19,13.23
  Top 0.381: T1.K7_1 132.62,15.84 133.96,14.5 135.91,14.5 137.19,13.23
U7-T6K8
  Top 0.3: U7.11 134.1,11.68
  Top 0.381: T1.K8_1 129.5,19.13 129.5,16.28 134.1,11.68
U7-T6K9
  Top 0.3: U7.12 132.36,10.83
  Top 0.381: T1.K9_1 128.43,21.12 128.43,14.76 132.36,10.83
U7-T6LDP
  Top 0.3: U7.3 140.69,13.44
  Top 0.381: R28.2 143.28,27.81 146.15,24.94 146.15,18.9 140.69,13.44
U7-T6LDP1
  Top 0.381: R28.1 140.38,35.85 139.11,34.59 T1.LDP_1
U7-T6RDP
  Top 0.3: U7.14 130.68,9.83
  Top 0.381: R27.2 129.59,27.15 126.47,24.03 126.47,14.05 130.68,9.83
U7-T6RDP1
  Top 0.381: R27.1 132.49,35.85 133.76,34.59 T1.RDP_1
U7-T7K0
  Top 0.3: U7.1 141.69,12.52
  Top 0.381: T0.K0_1 150.76,25.99 149.07,24.31 149.07,21.64 149.07,19.9 141.69,12.52
U7-T7K1
  Top 0.3: U7.36 156.92,6.83
  Top 0.381: T0.K1_1 163.87,25.99 165.53,24.33 165.53,15.44 156.92,6.83
U7-T7K2
  Top 0.3: U7.37 156.28,7.33
  Top 0.381: T0.K2_1 164.72,21.89 164.72,15.77 156.28,7.33
U7-T7K3
  Top 0.3: U7.38 155.63,7.83
  Top 0.381: T0.K3_1 163.91,19.64 163.91,16.1 155.63,7.83
U7-T7K4
  Top 0.3: U7.39 154.99,8.33
  Top 0.381: T0.K4_1 161.29,14.63 154.99,8.33
U7-T7K5
  Top 0.3: U7.40 154.35,8.83
  Top 0.381: T0.K5_1 158.86,13.34 154.35,8.83
U7-T7K6
  Top 0.3: U7.41 153.71,9.33
  Top 0.381: T0.K6_1 156.1,11.73 153.71,9.33
U7-T7K7
  Top 0.3: U7.42 151.5,9.83
  Top 0.381: T0.K7_1 153.67,12 151.5,9.83
U7-T7K8
  Top 0.3: U7.43 148.1,10.33
  Top 0.381: T0.K8_1 151.16,19.74 151.16,13.39 148.1,10.33
U7-T7K9
  Top 0.3: U7.44 147.23,10.83
  Top 0.381: T0.K9_1 150.09,21.73 150.09,13.69 147.23,10.83
U7-T7LDP
  Top 0.3: U7.35 157.64,6.33
  Top 0.381: R30.2 166.37,31.54 166.37,15.06 157.64,6.33
U7-T7LDP1
  Top 0.381: T0.LDP_1 160.15,31.67 R30.1
U7-T7RDP
  Top 0.3: U7.2 141.19,13
  Top 0.381: R29.2 150.65,27.46 148.06,24.87 148.06,19.86 141.19,13
U7-T7RDP1
  Top 0.381: R29.1 153.54,35.85 154.81,34.59 T0.RDP_1

### Text on the board
Top: DIVERGENCE METER / V3.0 | /u/xilyflob / 2021 | TOM TITOR / 2012 /a/
tPlace: IN-14 BOARD | CAUTION: / HIGH VOLTAGE
bPlace: CAUTION: / HIGH VOLTAGE
tStop: DIVERGENCE METER / V3.0 | /u/xilyflob / 2021 | TOM TITOR / 2012 /a/